# Altium schematic sheet sonar_board_rev_2013A.SchDoc
size A
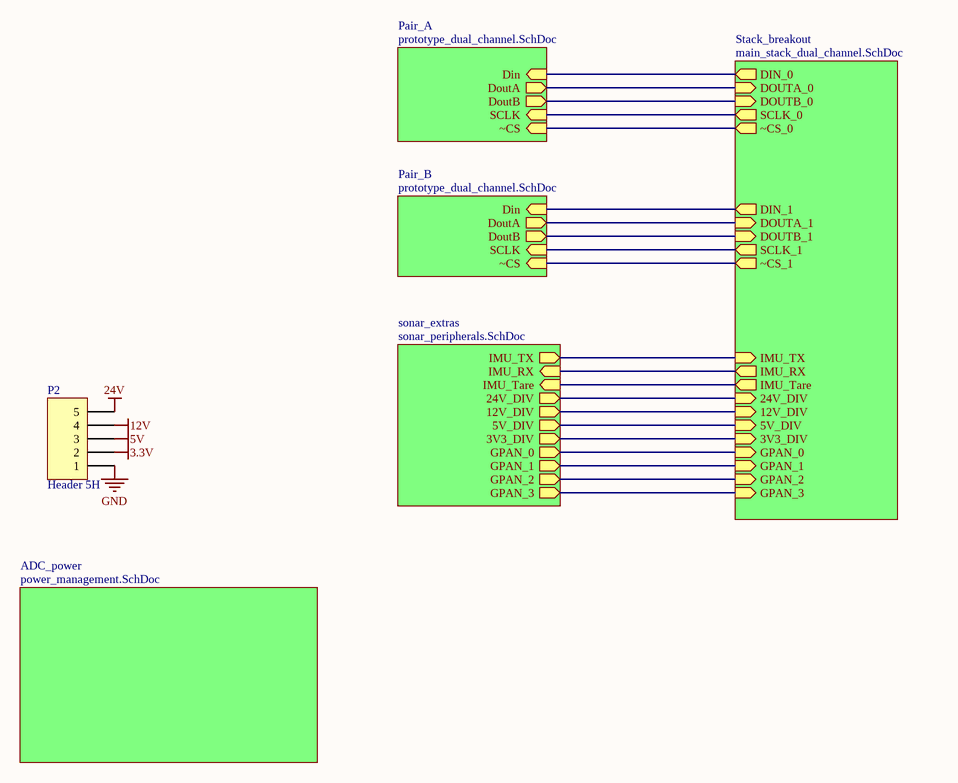
[diagram p0: sonar_board_rev_2013A.SchDoc]

## Parts
P2  Header 5H  [Molex_Minifit_JR_5CKT]

## Sub-sheets
ADC_power = power_management.SchDoc: no entries
Pair_A = prototype_dual_channel.SchDoc: Din (in), DoutA (out), DoutB (out), SCLK (in), ~CS (in)
Pair_B = prototype_dual_channel.SchDoc: SCLK (in), ~CS (in), DoutA (out), DoutB (out), Din (in)
sonar_extras = sonar_peripherals.SchDoc: IMU_TX (out), IMU_RX (in), IMU_Tare (in), 24V_DIV (out), 12V_DIV (out), 5V_DIV (out), 3V3_DIV (out), GPAN_1 (out), GPAN_2 (out), GPAN_3 (out), GPAN_0 (out)
Stack_breakout = main_stack_dual_channel.SchDoc: DIN_0 (out), DIN_1 (out), DOUTA_0 (in), DOUTA_1 (in), DOUTB_0 (in), DOUTB_1 (in), SCLK_0 (out), SCLK_1 (out), ~CS_0 (out), ~CS_1 (out), IMU_TX (in), IMU_RX (out), IMU_Tare (out), 24V_DIV (in), 12V_DIV (in), 5V_DIV (in), 3V3_DIV (in), GPAN_1 (in), GPAN_3 (in), GPAN_0 (in), GPAN_2 (in)

## Nets
3.3V: P2.2
5V: P2.3
12V: P2.4
24V: P2.5
GND: P2.1
(unnamed): sheet Pair_A/Din, sheet Stack_breakout/DIN_0
(unnamed): sheet Pair_A/DoutA, sheet Stack_breakout/DOUTA_0
(unnamed): sheet Pair_A/DoutB, sheet Stack_breakout/DOUTB_0
(unnamed): sheet Pair_A/SCLK, sheet Stack_breakout/SCLK_0
(unnamed): sheet Pair_A/~CS, sheet Stack_breakout/~CS_0
(unnamed): sheet Pair_B/SCLK, sheet Stack_breakout/SCLK_1
(unnamed): sheet Pair_B/~CS, sheet Stack_breakout/~CS_1
(unnamed): sheet Pair_B/DoutA, sheet Stack_breakout/DOUTA_1
(unnamed): sheet Pair_B/DoutB, sheet Stack_breakout/DOUTB_1
(unnamed): sheet Pair_B/Din, sheet Stack_breakout/DIN_1
(unnamed): sheet Stack_breakout/IMU_TX, sheet sonar_extras/IMU_TX
(unnamed): sheet Stack_breakout/IMU_RX, sheet sonar_extras/IMU_RX
(unnamed): sheet Stack_breakout/IMU_Tare, sheet sonar_extras/IMU_Tare
(unnamed): sheet Stack_breakout/24V_DIV, sheet sonar_extras/24V_DIV
(unnamed): sheet Stack_breakout/12V_DIV, sheet sonar_extras/12V_DIV
(unnamed): sheet Stack_breakout/5V_DIV, sheet sonar_extras/5V_DIV
(unnamed): sheet Stack_breakout/3V3_DIV, sheet sonar_extras/3V3_DIV
(unnamed): sheet Stack_breakout/GPAN_1, sheet sonar_extras/GPAN_1
(unnamed): sheet Stack_breakout/GPAN_3, sheet sonar_extras/GPAN_3
(unnamed): sheet Stack_breakout/GPAN_0, sheet sonar_extras/GPAN_0
(unnamed): sheet Stack_breakout/GPAN_2, sheet sonar_extras/GPAN_2

## Library data of the parts
P2 = Header 5H: Header, 5-Pin, Right Angle; LatestRevisionDate: 17-Jul-2002; LatestRevisionNote: Re-released for DXP Platform.; Publisher: Altium Limited